# EasyEDA Pro project 300w余嘉祥.eprj

# Schematic 高瓦充电
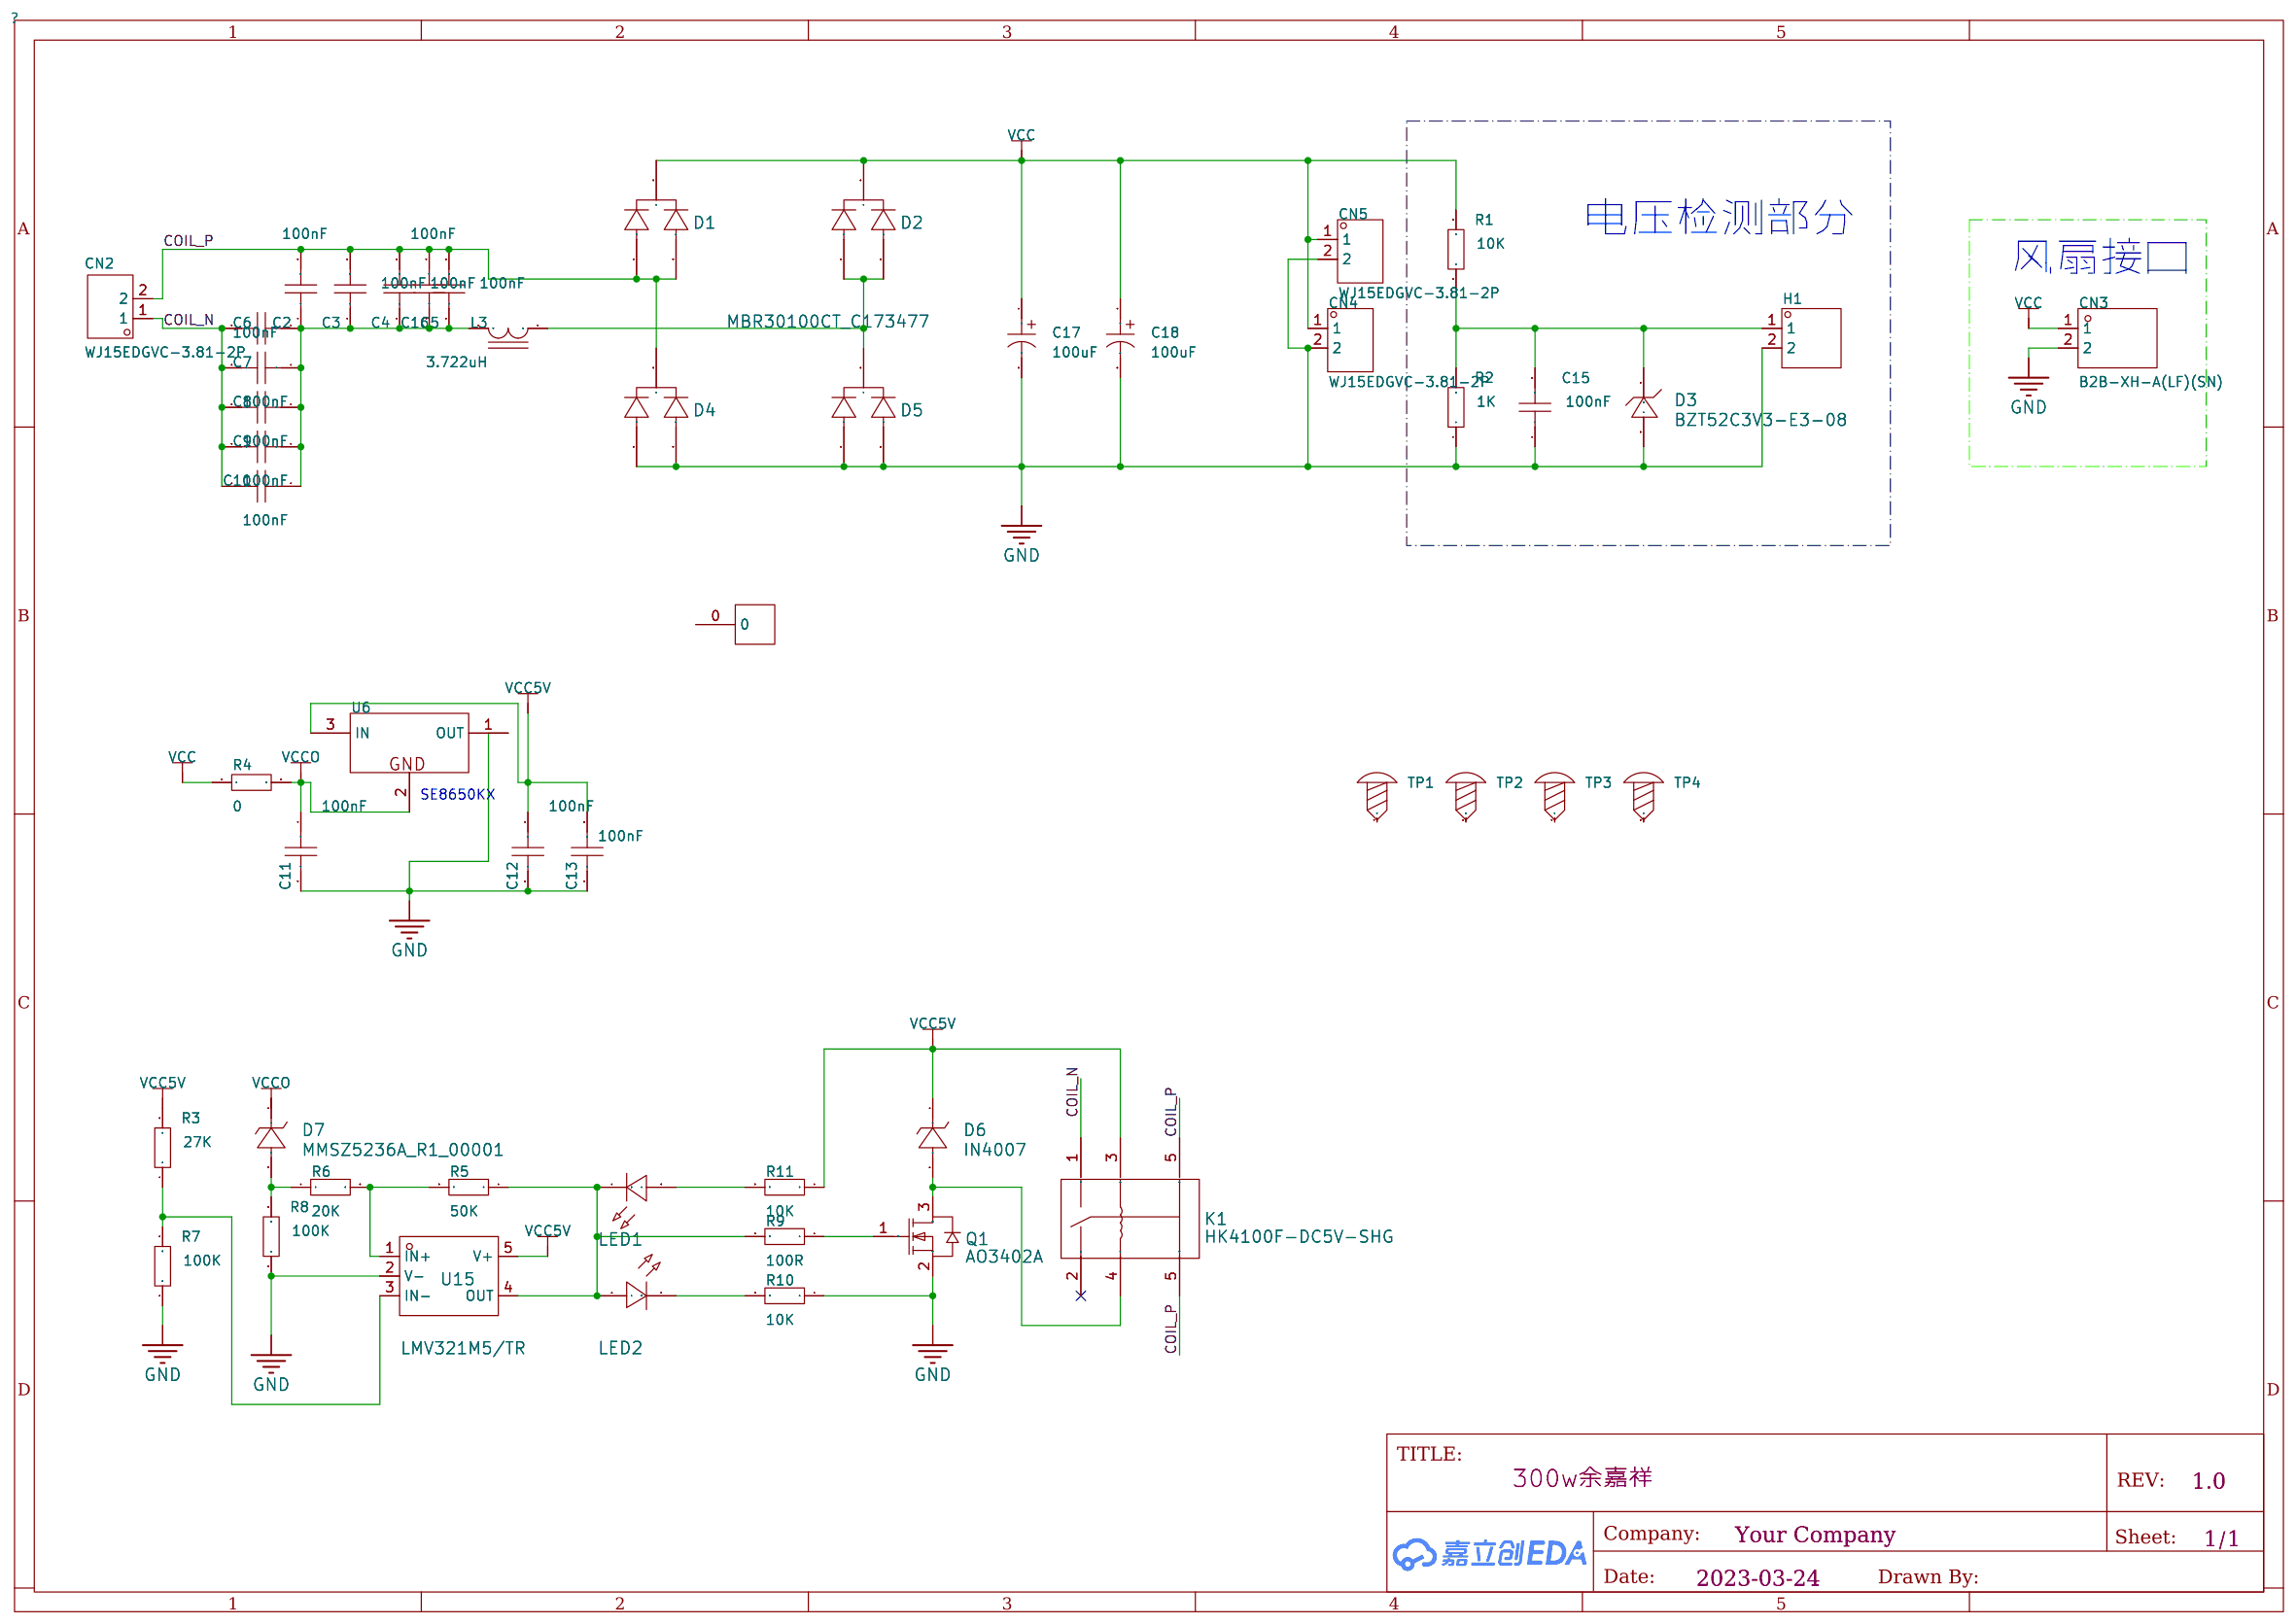
[diagram p0: schematic sheet]

## Parts
C2  100nF  [C1206]
C3  100nF  [C1206]
C4  100nF  [C1206]
C5  100nF  [C1206]
C6  100nF  [C1206]
C7  100nF  [C1206]
C8  100nF  [C1206]
C9  100nF  [C1206]
C10  100nF  [C1206]
C11  100nF  [C1206]
C12  100nF  [C1206]
C13  100nF  [C0603]
C15  100nF  [C0603]
C16  100nF  [C1206]
C17  100uF  [CAP-TH_BD10.0-P5.00-D0.6-FD]
C18  100uF  [CAP-TH_BD10.0-P5.00-D0.6-FD]
CN2  WJ15EDGVC-3.81-2P  [CONN-TH_WJ15EDGVC-3.81-2P]
CN3  B2B-XH-A(LF)(SN)  [CONN-TH_B2B-XH-A-LF-SN]
CN4  WJ15EDGVC-3.81-2P  [CONN-TH_WJ15EDGVC-3.81-2P]
CN5  WJ15EDGVC-3.81-2P  [CONN-TH_WJ15EDGVC-3.81-2P]
D1  MBR30100CT  [TO-220AB-3_L10.3-W5.0-P2.54-L]
D2  MBR30100CT  [TO-220AB-3_L10.3-W5.0-P2.54-L]
D3  BZT52C3V3-E3-08  [SOD-123_L2.7-W1.6-LS3.7-RD]
D4  MBR30100CT_C173477  [TO-220AB-3_L10.3-W5.0-P2.54-L]
D5  MBR30100CT  [TO-220AB-3_L10.3-W5.0-P2.54-L]
D6  IN4007  [SOD-123F_L2.7-W1.6-LS3.8-RD-1]
D7  MMSZ5236A_R1_00001  [SOD-123F_L2.7-W1.6-LS3.8-RD-1]
H1  -  [HDR-TH_2P-P2.54-V-M-1]
K1  HK4100F-DC5V-SHG  [RELAY-TH_HK4100F-DC5V-SHG]
L3  3.722uH  [T94/106-LAY]
LED1  -  [LED0805-RD_RED]
LED2  -  [LED0805-RD_RED]
Q1  AO3402A  [SOT-23-3_L2.9-W1.3-P1.90-LS2.4-BR]
R1  10K  [R0603]
R2  1K  [R0603]
R3  27K  [R0603]
R4  0  [R0603]
R5  50K  [R0603]
R6  20K  [R0603]
R7  100K  [R0603]
R8  100K  [R0603]
R9  100R  [R0603]
R10  10K  [R0603]
R11  10K  [R0603]
TP1  -  [M3螺丝]
TP2  -  [M3螺丝]
TP3  -  [M3螺丝]
TP4  -  [M3螺丝]
U1  -  [Cooler-5.5]
U6  UMW78L05  [SOT-89-3_L4.5-W2.5-P1.50-LS4.2-BR]
U15  LMV321M5/TR  [SOT-23-5_L3.0-W1.7-P0.95-LS2.8-BL]

## Library data of the parts
C2-C12 C16 = CAP_1206: 容值:100nF;精度:±10%;额定电压:50V;温度系数:X7R;; Supplier Footprint: 1206
C13 C15 = CAP_0603: 容值:100nF;精度:±10%;额定电压:50V;温度系数:X7R;; Supplier Footprint: 0603
C17 C18 = KNH2470UF35V149EC0017: 类型:-;容值:470uF;精度:±20%;额定电压:35V;纹波电流:-;等效串联电阻:-;; LCSC Part Name: 470uF ±20% 35V; Supplier Part: C2927897; Manufacturer: KNSCHA(科尼盛); Supplier Footprint: 插件,10x13mm; JLCPCB Part Class: Extended Part; Datasheet: https://atta.szlcsc.com/upload/public/pdf/source/20220426/0B046F5978A4E38228935D1BEC5299E1.pdf; Supplier: LCSC; Tolerance: ±20%; Rated Voltage: 35V; φD: 10mm; L: 13mm; Operating Temperature: -55℃~+105℃
CN2 CN4 CN5 = WJ15EDGVC-3.81-2P: 连接器类型:板端/插座-闭口;结构:1x2P;间距:3.81mm;排数:1;每排PIN数:2;安装方式:直针;颜色:绿色;; LCSC Part Name: 板端/插座-闭口 1x2P 3.81mm 排数:1 每排P数:2 直针; Supplier Part: C8396; Manufacturer: KANGNEX(康奈克斯电气); Supplier Footprint: 插件,P=3.81mm; JLCPCB Part Class: Extended Part; Datasheet: https://atta.szlcsc.com/upload/public/pdf/source/20191225/C8396_DFFE6D58C2AF45781C2AF0BF2B733CCC.pdf; Supplier: LCSC; Connector Type: 板端/插座-闭口; Structure: 1x2P; Pitch: 3.81mm; Number of Rows: 1; Number of PINs Per Row: 2; Mounting Style: 直针; Color: 绿色
CN3 = B2B-XH-A(LF)(SN): 参考系列:XH;间距:2.5mm;插针结构:1x2P;排数:1;每排PIN数:2;行距:-;安装方式:-;触头材质:黄铜;; LCSC Part Name: XH 2.5mm 1x2P; Supplier Part: C158012; Manufacturer: JST; Supplier Footprint: 插件,P=2.5mm; JLCPCB Part Class: Extended Part; Datasheet: https://atta.szlcsc.com/upload/public/pdf/source/20180319/9D0AC2122F92891443E3C996983D6D0E.pdf; Supplier: LCSC; Reference Series: XH; Pitch: 2.5mm; Pins Structure: 1x2P; Number of Rows: 1; Number of PINs Per Row: 2; Contact Material: 黄铜
D1 D2 D4 D5 = MBR30100CT: Supplier: LCSC; Supplier Part: C173477; Manufacturer: MDD; JLCPCB Part Class: Extended Part
D3 = BZT52C3V3-E3-08: Supplier: LCSC; Supplier Part: C467526; Manufacturer: VISHAY(威世); JLCPCB Part Class: Extended Part
D6 D7 = MMSZ5236A_R1_00001: Supplier: LCSC; Supplier Part: C391552; Manufacturer: PANJIT(强茂); JLCPCB Part Class: Extended Part
H1 = HDR-M_2.54_1x2P: Supplier Part: C124375; Supplier Footprint: 插件
K1 = HK4100F-DC5V-SHG: Supplier: LCSC; Manufacturer: 汇科; Supplier Part: C12072; JLCPCB Part Class: Extended Part
L3 = Ind-Power_2: Published: 8-Jun-2000; Revision: July-2002: Re-released for DXP Platform.; Publisher: Altium Limited; Imax: 50mA; DCR: .5m; Price(RMB): 0.000; Origin Footprint 2: CD31; Origin Footprint 3: CD32; Origin Footprint 4: CD42; Origin Footprint 5: CD43; Origin Footprint 6: CD52; Origin Footprint 7: CD53; Origin Footprint 8: CD54; Origin Footprint 9: CD73; Origin Footprint 10: CD75; Origin Footprint 11: CD104; Origin Footprint 12: CD105; Origin Footprint 13: CD106; Origin Footprint 14: 127 Shielded 12.5*12.5*7; Origin Footprint 15: 0630 TPC 7*7*3; Origin Footprint 16: 1050 TPC 10*10*5; Origin Footprint 17: 1265 TPC 12*12*6.5; Origin Footprint 18: CD104R; Origin Footprint 19: SLO2520; Origin Footprint 20: 1365 TPC 13*13*6.5; Origin Footprint 21: T80125
LED1 LED2 = LED_0805-R: Supplier Footprint: 0805
Q1 = AO3402A: Supplier: LCSC; Supplier Part: C347477; Manufacturer: UMW(广东友台半导体); JLCPCB Part Class: Extended Part
R1-R11 = Res_0603: Supplier Footprint: 0603
TP1-TP4 = M3螺丝: Supplier Footprint: 插件
U1 = fan
U6 = UMW78L05: Supplier Part: C347258; Manufacturer: UMW(友台半导体); Supplier Footprint: SOT-89; JLCPCB Part Class: 扩展库; Datasheet: https://atta.szlcsc.com/upload/public/pdf/source/20190326/C347258_49F40F3DBDAE0D5716334DB8D4B2CA4D.pdf; Supplier: LCSC
U15 = LMV321M5/TR: Supplier: LCSC; Supplier Part: C565365; Manufacturer: HGC(华冠); JLCPCB Part Class: Extended Part

## Nets
GND: C11.2 C12.2 C13.1 C15.1 C17.2 C18.2 CN3.2 CN4.2 CN5.2 D3.2(A) D4.1(A1) D4.3(A2) D5.1(A1) D5.3(A2) H1.2 Q1.2(S) R2.1 R7.1 R8.1 R10.1 U6.1(OUT) U15.2(V-)
VCC: C17.1 C18.1 CN3.1 CN4.1 CN5.1 D1.2(K) D2.2(K) R1.2 R4.1
VCC5V: C12.1 C13.2 D6.1(K) K1.3 R3.2 R11.1 U6.3(IN) U15.5(V+)
VCCO: C11.1 D7.1(K) R4.2 U6.2(GND)
COIL_N: C6.2 C7.2 C8.2 C9.2 C10.2 CN2.1 K1.1
COIL_P: C2.2 C3.2 C4.2 C5.2 C16.2 CN2.2 D1.1(A1) D1.3(A2) D4.2(K) K1.5
$C2_1: C2.1 C3.1 C4.1 C5.1 C6.1 C7.1 C8.1 C9.1 C10.1 C16.1 L3.2
$C15_2: C15.2 D3.1(C) H1.1 R1.1 R2.2
$D2_1: D2.1(A1) D2.3(A2) D5.2(K) L3.1
$D6_2: D6.2(A) K1.4 Q1.3(D)
$D7_2: D7.2(A) R6.1 R8.2
$LED1_1: LED1.1(C) LED2.2(A) R5.1 R9.2 U15.4(OUT)
$LED1_2: LED1.2(A) R11.2
$LED2_1: LED2.1(C) R10.2
$Q1_1: Q1.1(G) R9.1
$R3_1: R3.1 R7.2 U15.3(IN-)
$R5_2: R5.2 R6.2 U15.1(IN+)

Not connected (* = marked no-connect by the designer): K1 2*; TP1 1; TP2 1; TP3 1; TP4 1; U1 0

## Notes on the sheet
- 电压检测部分
- 风扇接口
- SE8650KX

# Board 高瓦充电
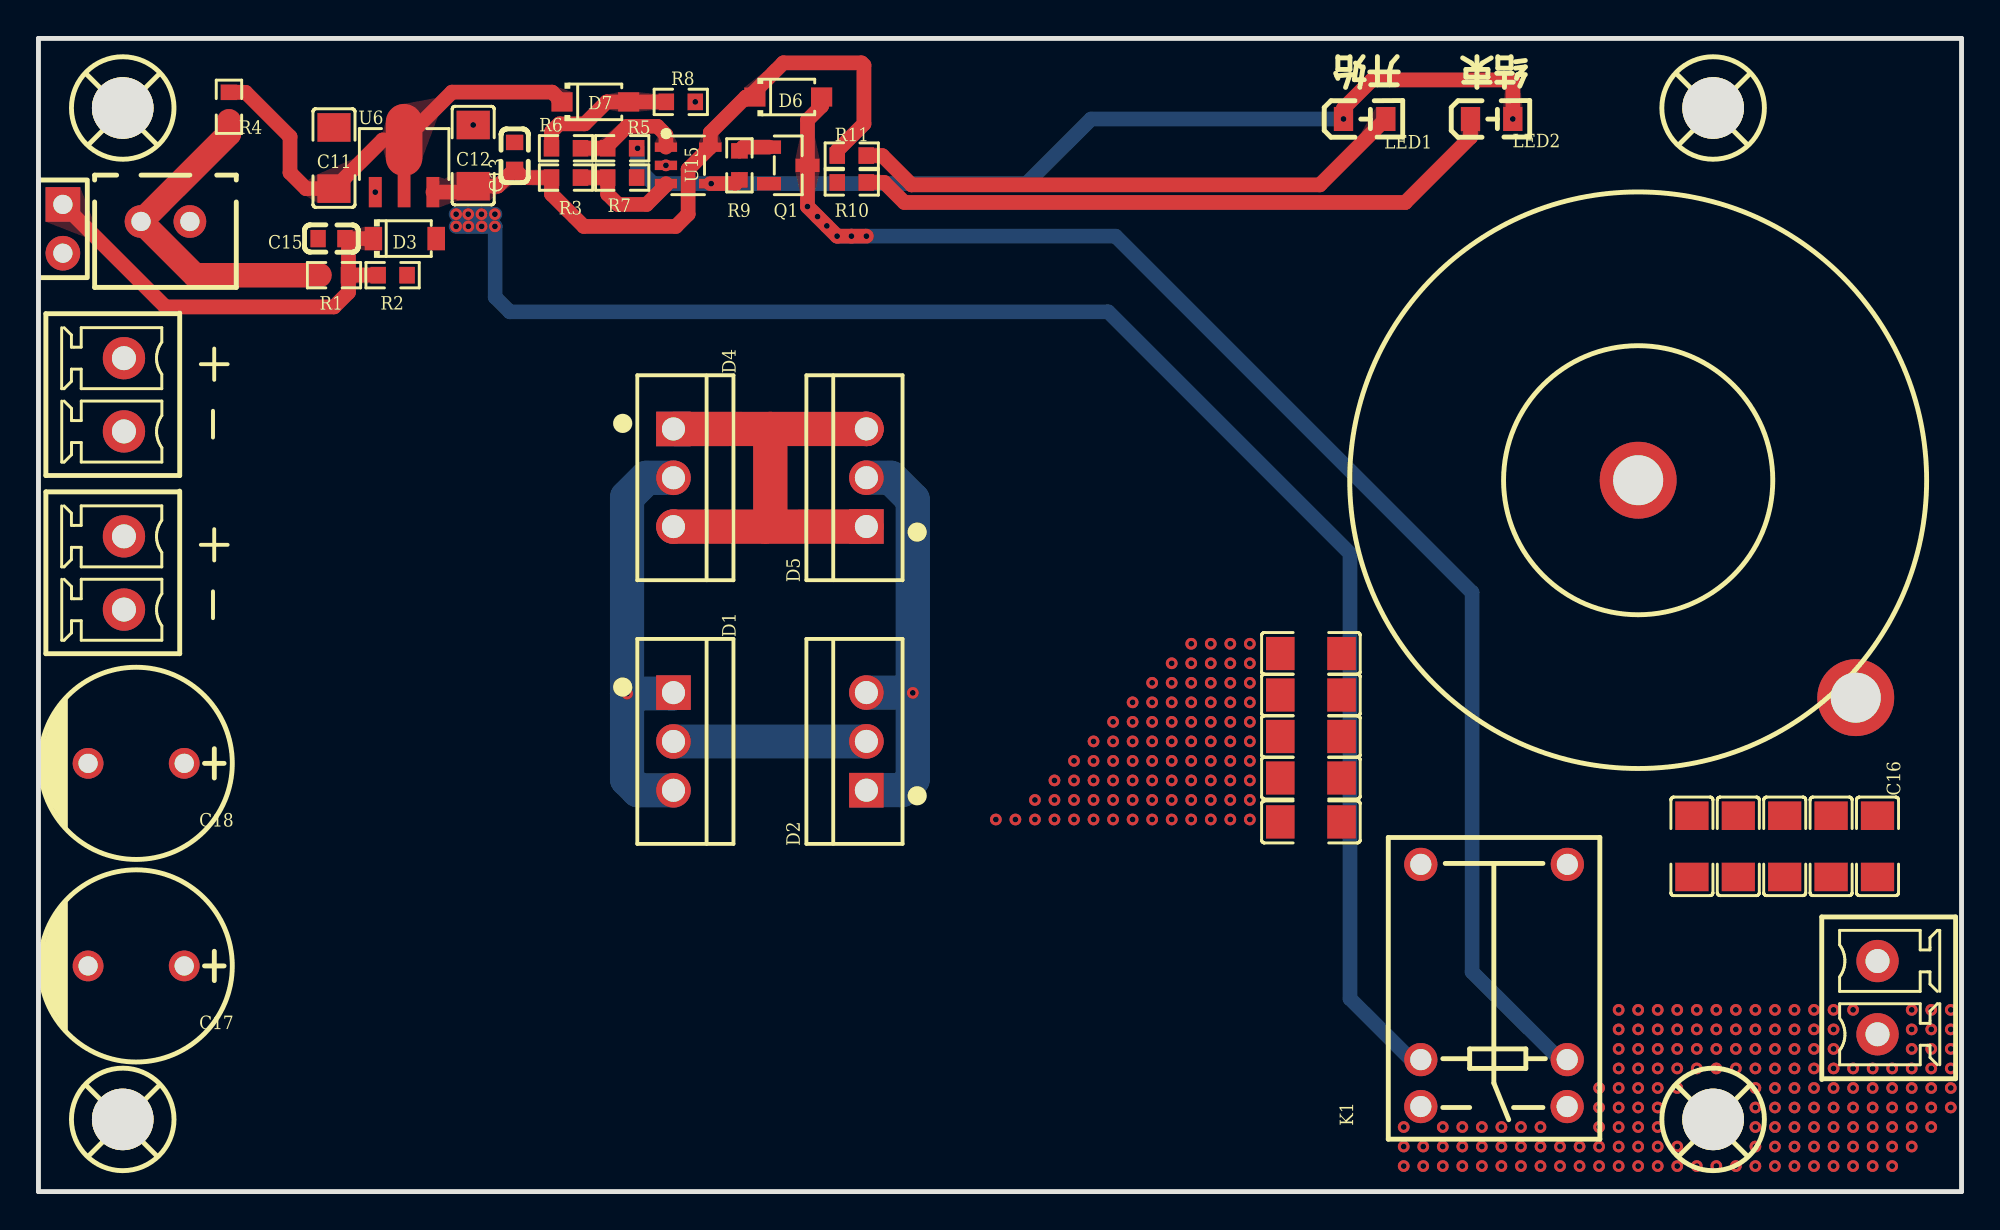
[diagram p1: board, top side]
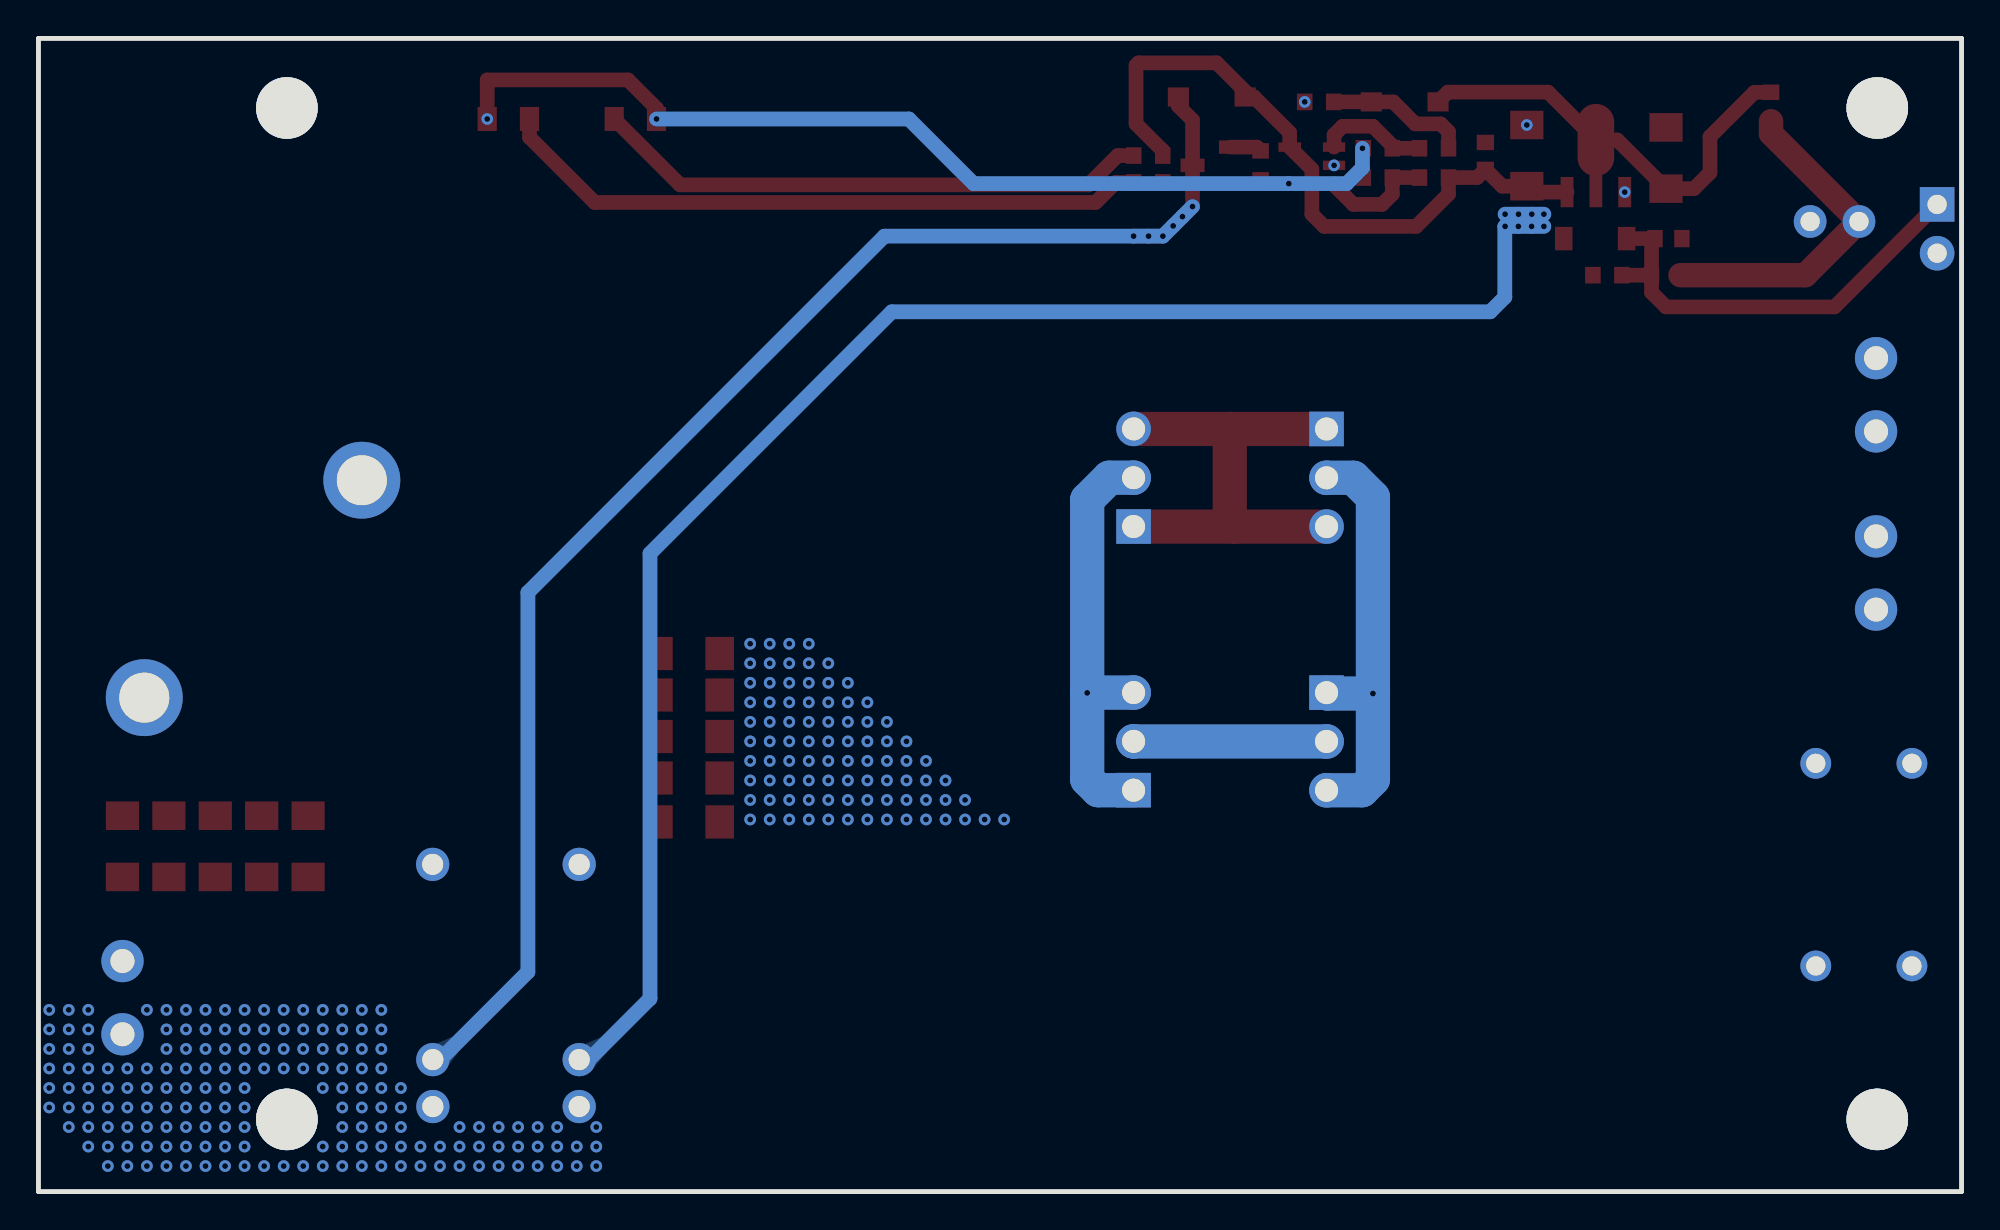
[diagram p2: board, bottom side, seen from below]

Outline 100 x 60 mm; copper layers: Top Layer, Bottom Layer. Coordinates in mm from the lower left corner of the outline.
Outline path: 0,60 0,0 arc(0,0) 0,0 100,0 arc(100,0) 100,0 100,60 arc(100,60) 100,60 0,60 arc(0,60) 0,60
Stack: Top Layer 0.035mm / Dielectric1 1.51mm FR4 er 4.5 / Bottom Layer 0.035mm

## Design rules (mm)
spacing Default (default): track to track 0.152, other pairs 0 to 0.152
track width Default (default): min 0.254, default 0.254, max 25.4
differential pair differentialPair (default): width min 0.127, default 0.254, max 2.54; gap min 0.152, default 0.152
via Default (default): diameter min 0.61, default 0.61, max 100.025; hole min 0.305, default 0.305, max 59.995
net COIL_P uses 111111
net COIL_N uses 111111
net GND uses 111111
net $C2_1 uses 111111
net VCC5V uses 111111
net VCC uses 111111
net $D2_1 uses 111111

## Placement (name value [footprint] x y rotation side)
C2  100nF  [C1206]  85.98 17.96 270 top
C3  100nF  [C1206]  88.39 17.96 270 top
C4  100nF  [C1206]  90.81 17.96 270 top
C5  100nF  [C1206]  93.22 17.96 270 top
C6  100nF  [C1206]  66.17 28 180 top
C7  100nF  [C1206]  66.17 25.84 180 top
C8  100nF  [C1206]  66.17 19.23 180 top
C9  100nF  [C1206]  66.17 21.52 180 top
C10  100nF  [C1206]  66.17 23.68 180 top
C11  100nF  [C1206]  15.37 53.78 90 top
C12  100nF  [C1206]  22.61 53.9 90 top
C13  100nF  [C0603]  24.76 53.89 270 top
C15  100nF  [C0603]  15.24 49.59 0 top
C16  100nF  [C1206]  95.63 17.96 270 top
C17  100uF  [CAP-TH_BD10.0-P5.00-D0.6-FD]  5.08 11.74 180 top
C18  100uF  [CAP-TH_BD10.0-P5.00-D0.6-FD]  5.08 22.28 180 top
CN2  WJ15EDGVC-3.81-2P  [CONN-TH_WJ15EDGVC-3.81-2P]  95.63 10.09 90 top
CN3  B2B-XH-A(LF)(SN)  [CONN-TH_B2B-XH-A-LF-SN]  6.6 50.47 180 top
CN4  WJ15EDGVC-3.81-2P  [CONN-TH_WJ15EDGVC-3.81-2P]  4.44 32.19 270 top
CN5  WJ15EDGVC-3.81-2P  [CONN-TH_WJ15EDGVC-3.81-2P]  4.44 41.46 270 top
D1  MBR30100CT  [TO-220AB-3_L10.3-W5.0-P2.54-L]  33.02 23.42 270 top
D2  MBR30100CT  [TO-220AB-3_L10.3-W5.0-P2.54-L]  43.05 23.42 90 top
D3  BZT52C3V3-E3-08  [SOD-123_L2.7-W1.6-LS3.7-RD]  19.05 49.59 0 top
D4  MBR30100CT_C173477  [TO-220AB-3_L10.3-W5.0-P2.54-L]  33.02 37.14 270 top
D5  MBR30100CT  [TO-220AB-3_L10.3-W5.0-P2.54-L]  43.05 37.14 90 top
D6  IN4007  [SOD-123F_L2.7-W1.6-LS3.8-RD-1]  38.99 56.95 0 top
D7  MMSZ5236A_R1_00001  [SOD-123F_L2.7-W1.6-LS3.8-RD-1]  28.96 56.7 0 top
H1  -  [HDR-TH_2P-P2.54-V-M-1]  1.27 50.09 270 top
K1  HK4100F-DC5V-SHG  [RELAY-TH_HK4100F-DC5V-SHG]  75.69 10.72 90 top
L3  3.722uH  [T94/106-LAY]  83.19 37.01 315 top
LED1  -  [LED0805-RD_RED]  68.96 55.81 0 top
LED2  -  [LED0805-RD_RED]  75.56 55.81 0 top
Q1  AO3402A  [SOT-23-3_L2.9-W1.3-P1.90-LS2.4-BR]  38.99 53.4 180 top
R1  10K  [R0603]  15.37 47.68 180 top
R2  1K  [R0603]  18.42 47.68 180 top
R3  27K  [R0603]  27.43 52.76 180 top
R4  0  [R0603]  9.91 56.44 90 top
R5  50K  [R0603]  30.35 54.28 180 top
R6  20K  [R0603]  27.43 54.28 0 top
R7  100K  [R0603]  30.35 52.76 180 top
R8  100K  [R0603]  33.4 56.7 180 top
R9  100R  [R0603]  36.45 53.4 270 top
R10  10K  [R0603]  42.29 52.51 0 top
R11  10K  [R0603]  42.29 53.9 0 top
TP1  -  [M3螺丝]  87.15 56.32 0 top
TP2  -  [M3螺丝]  4.45 3.69 0 top
TP3  -  [M3螺丝]  4.44 56.32 0 top
TP4  -  [M3螺丝]  87.15 3.69 0 top
U6  UMW78L05  [SOT-89-3_L4.5-W2.5-P1.50-LS4.2-BR]  19.01 53.36 270 top
U15  LMV321M5/TR  [SOT-23-5_L3.0-W1.7-P0.95-LS2.8-BL]  33.78 53.4 270 top

## Footprints (pads in the part's own frame, mm; a bottom-side part is the same pattern mirrored in y, then rotated)
C0603
  rect 0.8x0.9 smd: 1(-0.7,0) 2(0.7,0)
C1206
  rect 1.485x1.728 smd: 1(-1.593,0) 2(1.593,0)
CAP-TH_BD10.0-P5.00-D0.6-FD
  round 1.6 hole 1: 1(-2.5,0) 2(2.5,0)
CONN-TH_B2B-XH-A-LF-SN
  round 1.7 hole 1: 1(1.27,0) 2(-1.27,0)
CONN-TH_WJ15EDGVC-3.81-2P
  round 2.2 hole 1.25: 1(-1.905,0) 2(1.905,0)
HDR-TH_2P-P2.54-V-M-1
  rect 1.8x1.8 hole 1: 1(-1.27,0)
  round 1.8 hole 1: 2(1.27,0)
LED0805-RD_RED
  rect 1x1.25 smd: 1(-1.1,0) 2(1.1,0)
M3螺丝
  round 3.2 hole 3.2: 1(-0.064,0.064)
R0603
  rect 0.806x0.864 smd: 1(-0.753,0) 2(0.753,0)
RELAY-TH_HK4100F-DC5V-SHG
  round 1.727 hole 1.1: 1(-6.301,3.81) 2(-6.301,-3.8) 3(-3.86,3.81) 4(-3.86,-3.803) 5(6.301,-3.81) 6(6.301,3.81)
SOD-123_L2.7-W1.6-LS3.7-RD
  rect 0.91x1.22 smd: 1(-1.635,0) 2(1.635,0)
SOD-123F_L2.7-W1.6-LS3.8-RD-1
  rect 1.1x1 smd: 1(-1.735,0) 2(1.735,0)
SOT-23-3_L2.9-W1.3-P1.90-LS2.4-BR
  rect 1.25x0.7 smd: 1(1,-0.95) 2(1,0.95) 3(-1,0)
SOT-23-5_L3.0-W1.7-P0.95-LS2.8-BL
  rect 0.49x1.157 smd: 1(-0.95,-1.153) 2(0,-1.153) 3(0.95,-1.153)
  rect 0.49x1.175 smd: 4(0.95,1.153) 5(-0.95,1.153)
SOT-89-3_L4.5-W2.5-P1.50-LS4.2-BR
  rect 1.575x0.672 smd: 1(1.356,-1.5) 3(1.356,1.5)
  custom 5.377x1.9 smd: 2(-1.356,0)
T94/106-LAY
  round 4 hole 2.6: 1(0,0) 2(16,0)
TO-220AB-3_L10.3-W5.0-P2.54-L
  rect 1.8x1.8 hole 1.2: 1(-2.54,0)
  round 1.8 hole 1.2: 2(0,0) 3(2.54,0)

## Nets
As in the schematic.

Pads without a net: K1 2 6; TP1 1; TP2 1; TP3 1; TP4 1

## Via types
v1: diameter 0.61, hole 0.305, Top Layer to Bottom Layer, 276 vias

## Routing (per net, layer and track width the routed paths; a pad name or vN(x,y) marks a point on that pad's centre or on a via; arc(x,y) is an arc through that point)
GND: length 25.3
  Top Layer w1.778: D4.1 38.05,39.68 ; 38.05,39.68 43.05,39.68 D5.3 ; 38.05,39.68 38.05,34.86 37.79,34.6 ; D5.1 43.05,34.6 37.79,34.6 ; 33.02,34.6 37.79,34.6
  vias: v1(17.51,52) v1(22.61,55.5) v1(32.63,53.4) v1(34.15,56.7)
VCC: length 27.6
  Top Layer w1.27: R1.2 8.13,47.68 CN3.1 9.91,55.05 R4.1
  Bottom Layer w1.778: D1.2 43.05,23.42 D2.2
VCC5V: length 120.8
  Top Layer w0.762: R11.1 41.54,54.17 42.93,55.55 42.93,58.6 42.8,58.73 38.74,58.73 36.96,56.95 36.79,56.95 34.94,55.1 U15.5 33.78,53.19 33.78,50.86 33.15,50.22 28.35,50.22 26.68,51.9 R3.2 25.19,52.76 C13.2 23.88,52.31 C12.1 22.3,52 20.51,52
  Bottom Layer w0.762: v1(21.72,50.22) v1(22.36,50.22) v1(23.05,50.22) v1(23.74,50.22) 23.75,50.21 23.75,46.54 24.51,45.78 55.63,45.78 68.2,33.2 68.2,10.04 71.5,6.74 ; v1(23.74,50.86) v1(23.04,50.86) v1(22.35,50.86) v1(21.72,50.86)
VCCO: length 22.8
  Top Layer w0.762: R4.2 10.77,57.2 13.08,54.89 13.08,53.01 13.91,52.18 C11.1 17.9,54.72 19.01,54.72 21.5,57.21 26.71,57.21 D7.1
$C15_2: length 22.7
  Top Layer w0.762: H1.1 6.6,46.03 15.37,46.03 16.12,46.78 R1.1 ; R1.1 R2.2 ; R1.1 16.12,49.08 ; C15.2 17.42,49.59
$D2_1: length 22.5
  Bottom Layer w1.778: D2.3 45.45,25.96 v1(45.47,25.95) ; D2.1 44.89,20.88 45.47,21.46 v1(45.47,25.95) ; v1(45.47,25.95) 45.47,36 44.32,37.14 D5.2
$D6_2: length 78.8
  Top Layer w0.762: v1(43.05,49.71) v1(42.28,49.71) v1(41.53,49.71) v1(41,50.25) v1(40.51,50.73) v1(39.99,51.25) Q1.3 39.99,55.75 40.72,56.49 D6.2
  Bottom Layer w0.762: 79.11,6.86 74.55,11.43 74.55,31.17 56.01,49.71 v1(43.05,49.71) v1(42.28,49.71) v1(41.53,49.71) v1(41,50.25) v1(40.51,50.73) v1(39.99,51.25)
$D7_2: length 7.5
  Top Layer w0.762: R6.1 26.68,55.15 27.08,55.55 28.41,55.55 29.55,56.7 D7.2 R8.2
$LED1_1: length 53.1
  Top Layer w0.762: v1(67.86,55.81) 67.86,56.36 69.34,57.84 76.66,57.84 v1(76.66,55.81) ; R9.2 36.25,52.45 U15.4
  Bottom Layer w0.762: v1(31.15,54.28) 31.15,53.27 31.98,52.45 v1(34.98,52.45) 51.37,52.45 54.74,55.81 v1(67.86,55.81)
$LED1_2: length 29.1
  Top Layer w0.762: LED1.2 66.63,52.38 45.4,52.38 43.88,53.9 R11.2
$LED2_1: length 34.2
  Top Layer w0.762: R10.2 43.98,52.51 45.02,51.47 71.07,51.47 74.47,54.86 LED2.1
$Q1_1: length 1.6
  Top Layer w0.762: R9.1 36.65,54.35 Q1.1
$R3_1: length 6
  Top Layer w0.762: U15.3 32.63,52.37 31.62,51.36 30.13,51.36 29.6,51.9 R7.2 R3.1
$R5_2: length 5.8
  Top Layer w0.762: R6.2 R5.2 29.6,54.42 30.61,55.43 32.18,55.43 32.63,54.98 U15.1
COIL_N:
  vias: v1(49.78,19.36) v1(50.8,19.36) v1(51.82,20.38) v1(51.82,19.36) v1(52.83,21.39) v1(52.83,20.38) v1(52.83,19.36) v1(53.85,22.41) v1(53.85,21.39) v1(53.85,20.38) v1(53.85,19.36) v1(54.86,23.42) v1(54.86,22.41) v1(54.86,21.39) v1(54.86,20.38) v1(54.86,19.36) v1(55.88,24.44) v1(55.88,23.42) v1(55.88,22.41) v1(55.88,21.39) v1(55.88,20.38) v1(55.88,19.36) v1(56.9,25.46) v1(56.9,24.44) v1(56.9,23.42) v1(56.9,22.41) v1(56.9,21.39) v1(56.9,20.38) v1(56.9,19.36) v1(57.91,26.47) v1(57.91,25.46) v1(57.91,24.44) v1(57.91,23.42) v1(57.91,22.41) v1(57.91,21.39) v1(57.91,20.38) v1(57.91,19.36) v1(58.93,27.49) v1(58.93,26.47) v1(58.93,25.46) v1(58.93,24.44) v1(58.93,23.42) v1(58.93,22.41) v1(58.93,21.39) v1(58.93,20.38) v1(58.93,19.36) v1(59.94,28.5) v1(59.94,27.49) v1(59.94,26.47) v1(59.94,25.46) v1(59.94,24.44) v1(59.94,23.42) v1(59.94,22.41) v1(59.94,21.39) v1(59.94,20.38) v1(59.94,19.36) v1(60.96,28.5) v1(60.96,27.49) v1(60.96,26.47) v1(60.96,25.46) v1(60.96,24.44) v1(60.96,23.42) v1(60.96,22.41) v1(60.96,21.39) v1(60.96,20.38) v1(60.96,19.36) v1(61.98,28.5) v1(61.98,27.49) v1(61.98,26.47) v1(61.98,25.46) v1(61.98,24.44) v1(61.98,23.42) v1(61.98,22.41) v1(61.98,21.39) v1(61.98,20.38) v1(61.98,19.36) v1(62.99,28.5) v1(62.99,27.49) v1(62.99,26.47) v1(62.99,25.46) v1(62.99,24.44) v1(62.99,23.42) v1(62.99,22.41) v1(62.99,21.39) v1(62.99,20.38) v1(62.99,19.36) v1(70.99,3.36) v1(70.99,2.34) v1(70.99,1.33) v1(72.01,2.34) v1(72.01,1.33) v1(73.03,3.36) v1(73.03,2.34) v1(73.03,1.33) v1(74.04,3.36) v1(74.04,2.34) v1(74.04,1.33) v1(75.06,3.36) v1(75.06,2.34) v1(75.06,1.33) v1(76.07,3.36) v1(76.07,2.34) v1(76.07,1.33) v1(77.09,3.36) v1(77.09,2.34) v1(77.09,1.33) v1(78.1,3.36) v1(78.1,2.34) v1(78.1,1.33) v1(79.12,2.34) v1(79.12,1.33) v1(80.14,2.34) v1(80.14,1.33) v1(81.15,5.39) v1(81.15,4.37) v1(81.15,3.36) v1(81.15,2.34) v1(81.15,1.33) v1(82.17,9.45) v1(82.17,8.44) v1(82.17,7.42) v1(82.17,6.41) v1(82.17,5.39) v1(82.17,4.37) v1(82.17,3.36) v1(82.17,2.34) v1(82.17,1.33) v1(83.19,9.45) v1(83.19,8.44) v1(83.19,7.42) v1(83.19,6.41) v1(83.19,5.39) v1(83.19,4.37) v1(83.19,3.36) v1(83.19,2.34) v1(83.19,1.33) v1(84.2,9.45) v1(84.2,8.44) v1(84.2,7.42) v1(84.2,6.41) v1(84.2,5.39) v1(84.2,4.37) v1(84.2,3.36) v1(84.2,2.34) v1(84.2,1.33) v1(85.22,9.45) v1(85.22,8.44) v1(85.22,7.42) v1(85.22,6.41) v1(85.22,5.39) v1(85.22,2.34) v1(85.22,1.33) v1(86.23,9.45) v1(86.23,8.44) v1(86.23,7.42) v1(86.23,6.41) v1(86.23,1.33) v1(87.25,9.45) v1(87.25,8.44) v1(87.25,7.42) v1(87.25,6.41) v1(87.25,1.33) v1(88.26,9.45) v1(88.26,8.44) v1(88.26,7.42) v1(88.26,6.41) v1(88.26,1.33) v1(89.28,9.45) v1(89.28,8.44) v1(89.28,7.42) v1(89.28,6.41) v1(89.28,5.39) v1(89.28,4.37) v1(89.28,3.36) v1(89.28,2.34) v1(89.28,1.33) v1(90.3,9.45) v1(90.3,8.44) v1(90.3,7.42) v1(90.3,6.41) v1(90.3,5.39) v1(90.3,4.37) v1(90.3,3.36) v1(90.3,2.34) v1(90.3,1.33) v1(91.31,9.45) v1(91.31,8.44) v1(91.31,7.42) v1(91.31,6.41) v1(91.31,5.39) v1(91.31,4.37) v1(91.31,3.36) v1(91.31,2.34) v1(91.31,1.33) v1(92.33,9.45) v1(92.33,8.44) v1(92.33,7.42) v1(92.33,6.41) v1(92.33,5.39) v1(92.33,4.37) v1(92.33,3.36) v1(92.33,2.34) v1(92.33,1.33) v1(93.34,9.45) v1(93.34,8.44) v1(93.34,7.42) v1(93.34,6.41) v1(93.34,5.39) v1(93.34,4.37) v1(93.34,3.36) v1(93.34,2.34) v1(93.34,1.33) v1(94.36,9.45) v1(94.36,6.41) v1(94.36,5.39) v1(94.36,4.37) v1(94.36,3.36) v1(94.36,2.34) v1(94.36,1.33) v1(95.38,6.41) v1(95.38,5.39) v1(95.38,4.37) v1(95.38,3.36) v1(95.38,2.34) v1(95.38,1.33) v1(96.39,6.41) v1(96.39,5.39) v1(96.39,4.37) v1(96.39,3.36) v1(96.39,2.34) v1(96.39,1.33) v1(97.41,9.45) v1(97.41,8.44) v1(97.41,7.42) v1(97.41,6.41) v1(97.41,5.39) v1(97.41,4.37) v1(97.41,3.36) v1(97.41,2.34) v1(98.43,9.45) v1(98.43,8.44) v1(98.43,7.42) v1(98.43,6.41) v1(98.43,5.39) v1(98.43,4.37) v1(98.43,3.36) v1(99.44,9.45) v1(99.44,8.44) v1(99.44,7.42) v1(99.44,6.41) v1(99.44,5.39) v1(99.44,4.37)
COIL_P: length 22.6
  Bottom Layer w1.778: D1.1 32.97,25.91 v1(30.61,25.91) ; v1(30.61,25.91) 30.61,21.45 31.18,20.88 33.02,20.88 ; v1(30.61,25.91) 30.61,36.12 31.62,37.14 D4.2

## Copper pours and planes (outline as drawn; the poured copper is in the pictures)
GND on Top Layer: -1.04,61.82 65.76,61.82 65.76,-0.54 -1.04,-0.54
GND on Bottom Layer: -1.04,61.82 65.76,61.82 65.76,-0.54 -1.04,-0.54
VCC on Bottom Layer: 31.88,24.44 31.88,22.41 34.54,22.41 34.54,19.61 30.73,19.61 30.73,9.71 30.99,9.45 40.08,9.45 41.98,11.36 41.98,22.1 42.16,22.28 43.56,22.28 44.07,22.79 44.07,24.44 41.78,24.57 32,24.57
VCC on Bottom Layer: 6.28,38.71 6.28,41.1 5.89,41.49 2.77,41.49 1.74,42.52 1.74,46.12 2.92,47.3 2.92,51.49 3.68,52.25 6.39,52.25 6.6,52.04 6.6,48.95 10.8,44.76 22.63,44.76 25.53,41.86 25.53,39.3 24.94,38.71
VCC on Bottom Layer: 33.78,22.41 31.83,22.41 31.14,21.72 31.14,9.45 5.08,9.45 5.08,27.66 6.01,28.59 6.01,32.36 3.52,32.36 1.97,33.91 1.97,38.46 3.57,40.06 25.65,40.06 31.14,34.57 31.14,24.79 31.36,24.57 33.78,24.57 34.21,24.13 34.21,22.84
VCC5V on Top Layer: 21.51,52.98 23.74,52.98 23.74,50.22 21.51,50.22
$C2_1 on Top Layer: 66.42,29.65 66.42,18.63 66.91,18.14 99.82,18.14 99.82,26.34 96.52,29.65
$D2_1 on Top Layer: 42.16,19.99 49.66,19.99 59.69,30.03 84.84,30.03 88.01,33.2 88.01,39.17 84.84,42.35 44.83,42.35 44.83,38.92 44.07,38.16 42.42,38.16 42.04,37.77 42.04,36.5 42.42,36.12 45.34,36.12 45.47,36 45.47,22.44 44.92,21.9 42.16,21.9
COIL_N on Top Layer: 99.69,9.82 82.05,9.82 80.92,8.69 69.98,8.69 67.44,6.15 67.44,1.71 68.71,0.44 95.76,0.44 99.73,4.41 99.73,9.78
COIL_N on Top Layer: 66.17,29.91 59.82,29.91 49.78,19.87 49.78,18.34 66.04,18.34 66.17,18.47
COIL_N on Bottom Layer: 71.12,3.99 79.71,3.99 82.04,6.32 82.04,9.83 99.69,9.83 99.69,4.4 95.76,0.47 95.76,0.44 71.12,0.44 70.99,0.31 70.99,3.87
COIL_N on Bottom Layer: 49.4,29.9 65.91,29.9 66.17,29.65 66.17,7.59 69.81,3.95 72.81,3.95 73.03,3.74 73.03,0.18 52.32,0.18 49.4,3.1
COIL_P on Top Layer: 31.14,38.53 34.15,38.53 34.74,37.94 34.74,36.6 33.88,35.74 30.61,35.74 30.61,28.28 31.14,27.75 33.65,27.75 34.67,26.73 34.67,24.82 31.56,24.82 31.29,24.56 31.29,22.49 31.84,21.93 34.74,21.93 34.74,8.7 33.82,7.78 10.6,7.78 10.6,38.57 10.8,38.76 30.91,38.76
COIL_P on Top Layer: 99.69,10.08 81.97,10.08 80.81,8.92 69.83,8.92 63.69,2.78 33.41,2.78 33.41,6.4 28.19,11.61 28.19,19.16 31.14,22.11 34.74,22.11 36.14,20.71 36.14,18.09 99.82,18.09 99.82,10.21

Small or netless copper shapes (teardrops, artwork), in the pictures only: 44 on Top Layer, 3 on Bottom Layer

## Text on the board
Top Silkscreen Layer: + | - | 开始 | 结束
